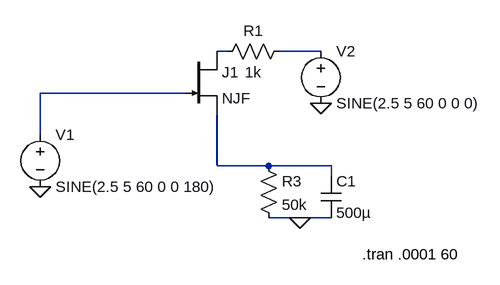
[diagram p0: schematic JFET_rectifier.asc]
JFET_rectifier.asc, the LTspice schematic file:
Version 4
SHEET 1 880 720
WIRE 432 256 416 256
WIRE 576 256 512 256
WIRE 368 320 144 320
WIRE 144 384 144 320
WIRE 416 432 416 352
WIRE 496 432 416 432
WIRE 592 432 496 432
WIRE 592 448 592 432
WIRE 544 512 496 512
WIRE 592 512 544 512
FLAG 144 464 0
FLAG 576 336 0
FLAG 544 512 0
SYMBOL Voltage 144 368 R0
SYMATTR InstName V1
SYMATTR Value SINE(2.5 5 60 0 0 180)
SYMBOL njf 368 256 R0
SYMATTR InstName J1
SYMBOL Voltage 576 240 R0
SYMATTR InstName V2
SYMATTR Value SINE(2.5 5 60 0 0 0)
SYMBOL Res 528 240 R90
WINDOW 0 0 56 VBottom 2
WINDOW 3 32 56 VTop 2
SYMATTR InstName R1
SYMATTR Value 1k
SYMBOL Res 480 416 R0
SYMATTR InstName R3
SYMATTR Value 50k
SYMBOL Cap 576 448 R0
SYMATTR InstName C1
SYMATTR Value 500µ
TEXT 640 568 Left 2 !.tran .0001 60

The netlist it stands for:
* JFET_rectifier.asc
V1 N003 0 SINE(2.5 5 60 0 0 180)
J1 N001 N003 N004 NJF
V2 N002 0 SINE(2.5 5 60 0 0 0)
R1 N002 N001 1k
R3 N004 0 50k
C1 N004 0 500µ
.model NJF NJF
.model PJF PJF
.lib standard.jft
.tran .0001 60
.backanno
.end